# Altium schematic sheet System_Overview.SchDoc
size A4; CompanyName: Zohm Control GmbH; Address1: Rittersbacher Straße 48c; Address2: 91126 Schwabach; Address3: GERMANY; DocumentNumber: 1; SheetNumber: 1; SheetTotal: 6; Website: www.zohm-control.com
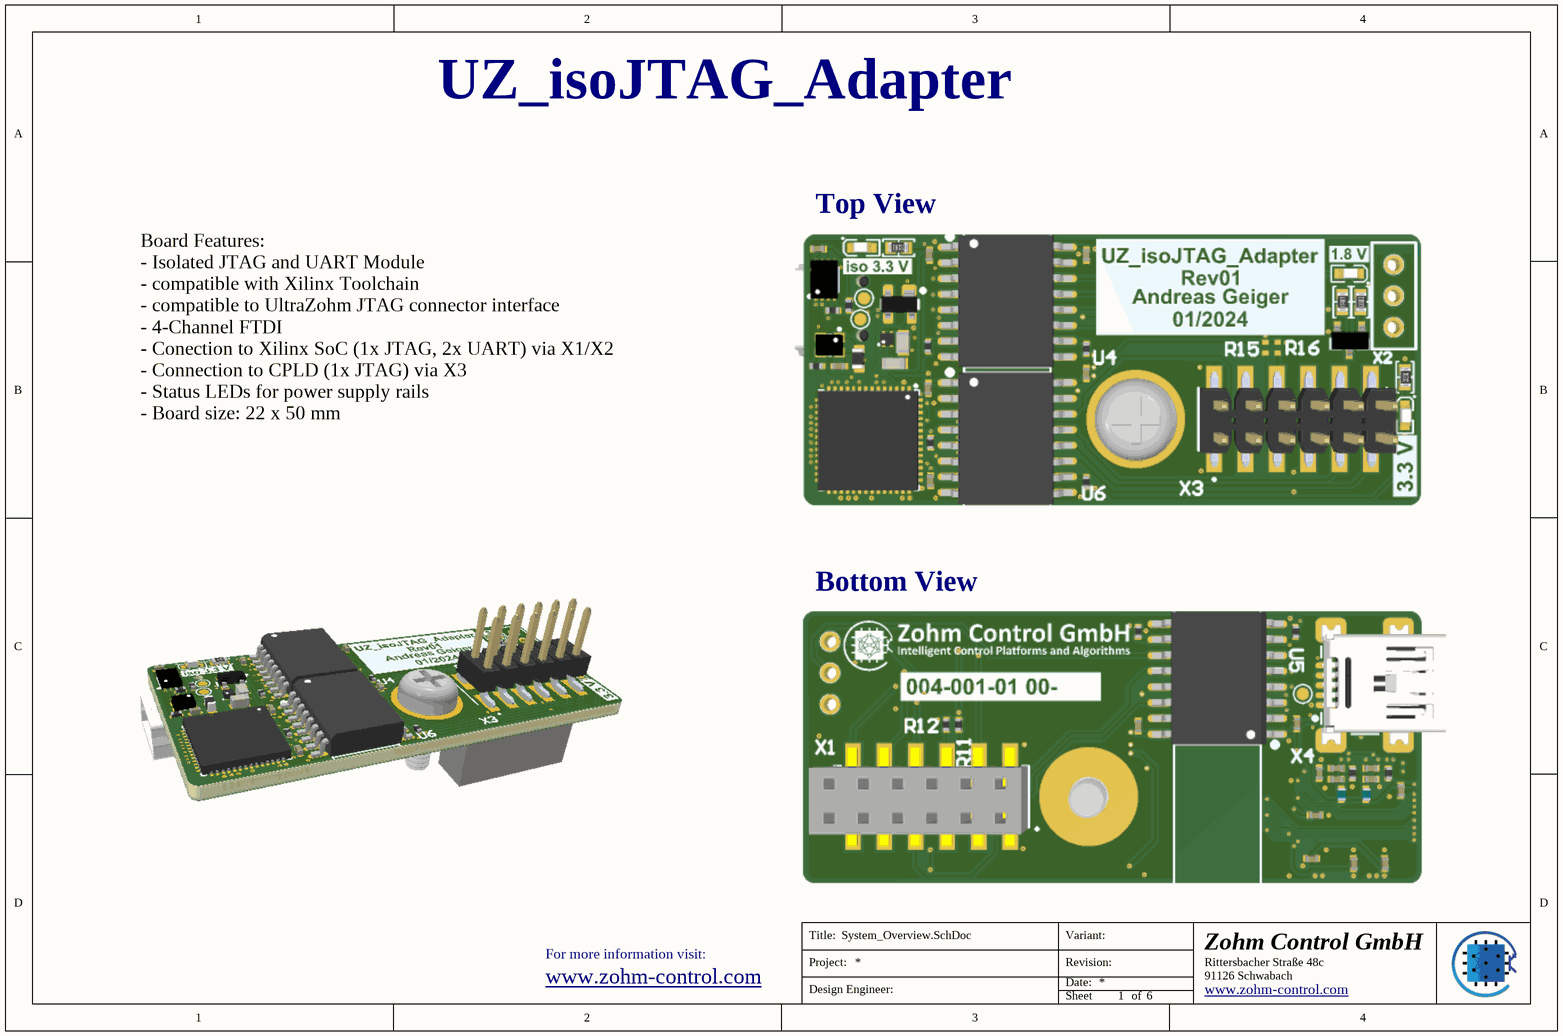
[diagram p0: System_Overview.SchDoc]

## Notes on the sheet
- UZ_isoJTAG_Adapter
- Top View
- Board Features:
  - Isolated JTAG and UART Module
  - compatible with Xilinx Toolchain
  - compatible to UltraZohm JTAG connector interface
  - 4-Channel FTDI
  - Conection to Xilinx SoC (1x JTAG, 2x UART) via X1/X2
  - Connection to CPLD (1x JTAG) via X3
  - Status LEDs for power supply rails
  - Board size: 22 x 50 mm
- Bottom View
- For more information visit:
- www.zohm-control.com <https://www.zohm-control.com>
- Title:
- Project:
- Date:
- Revision:
- Variant:
- Design Engineer:
- Sheet
- of